# Altium project WAB_1_1_r3.PrjPcb
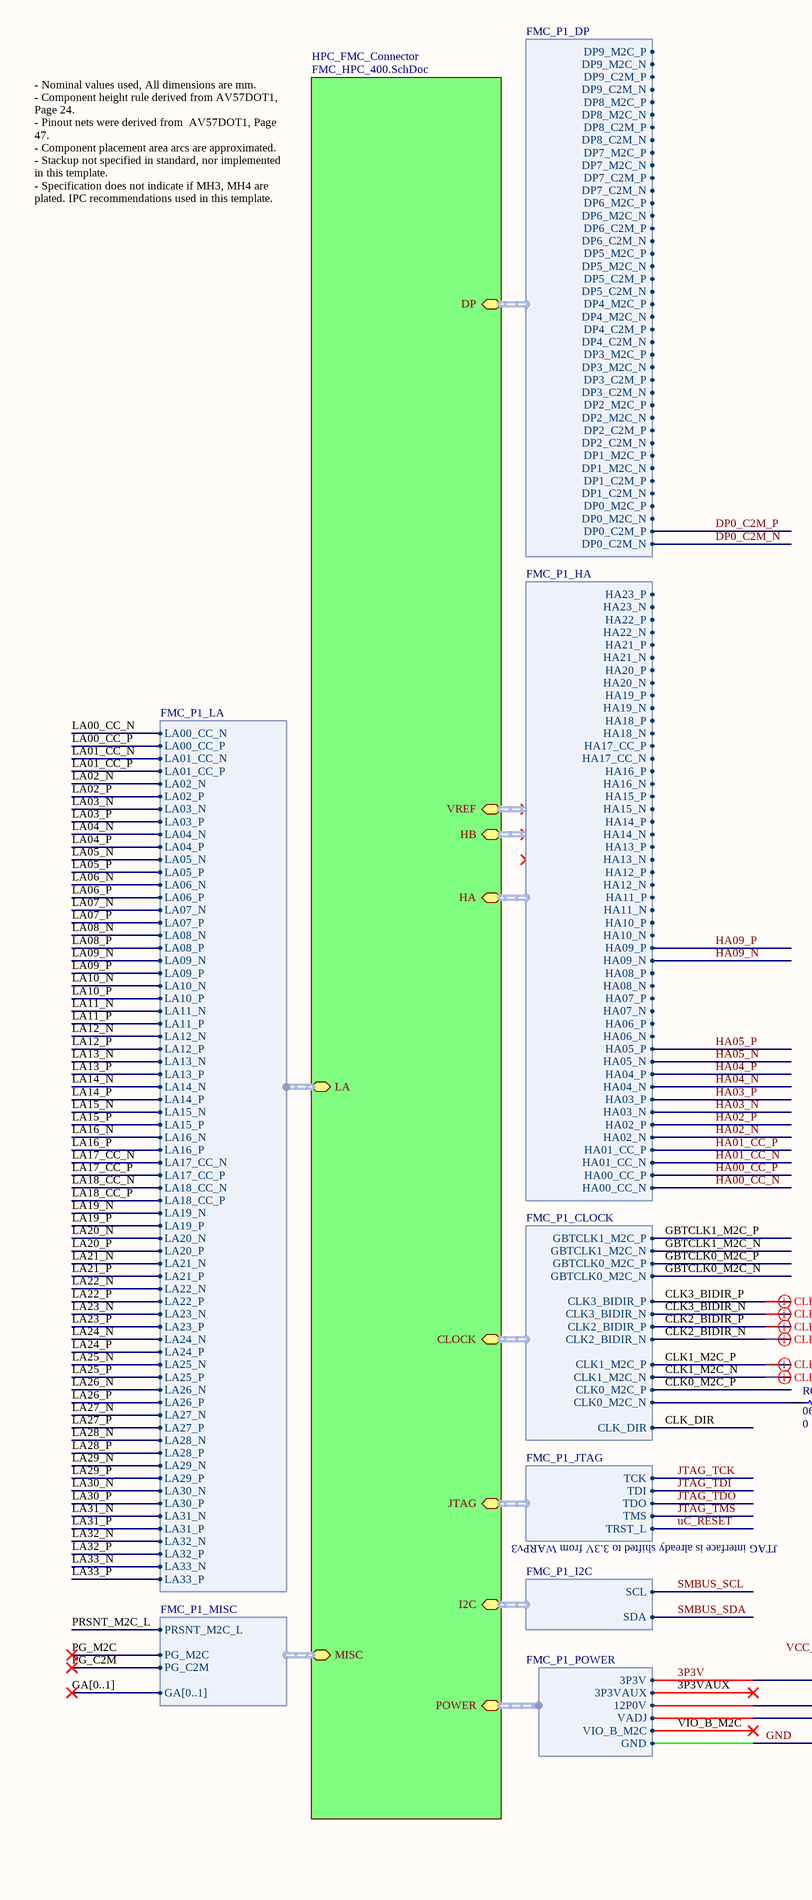
[diagram p0: WAB_1_1_top_level.SchDoc, left]
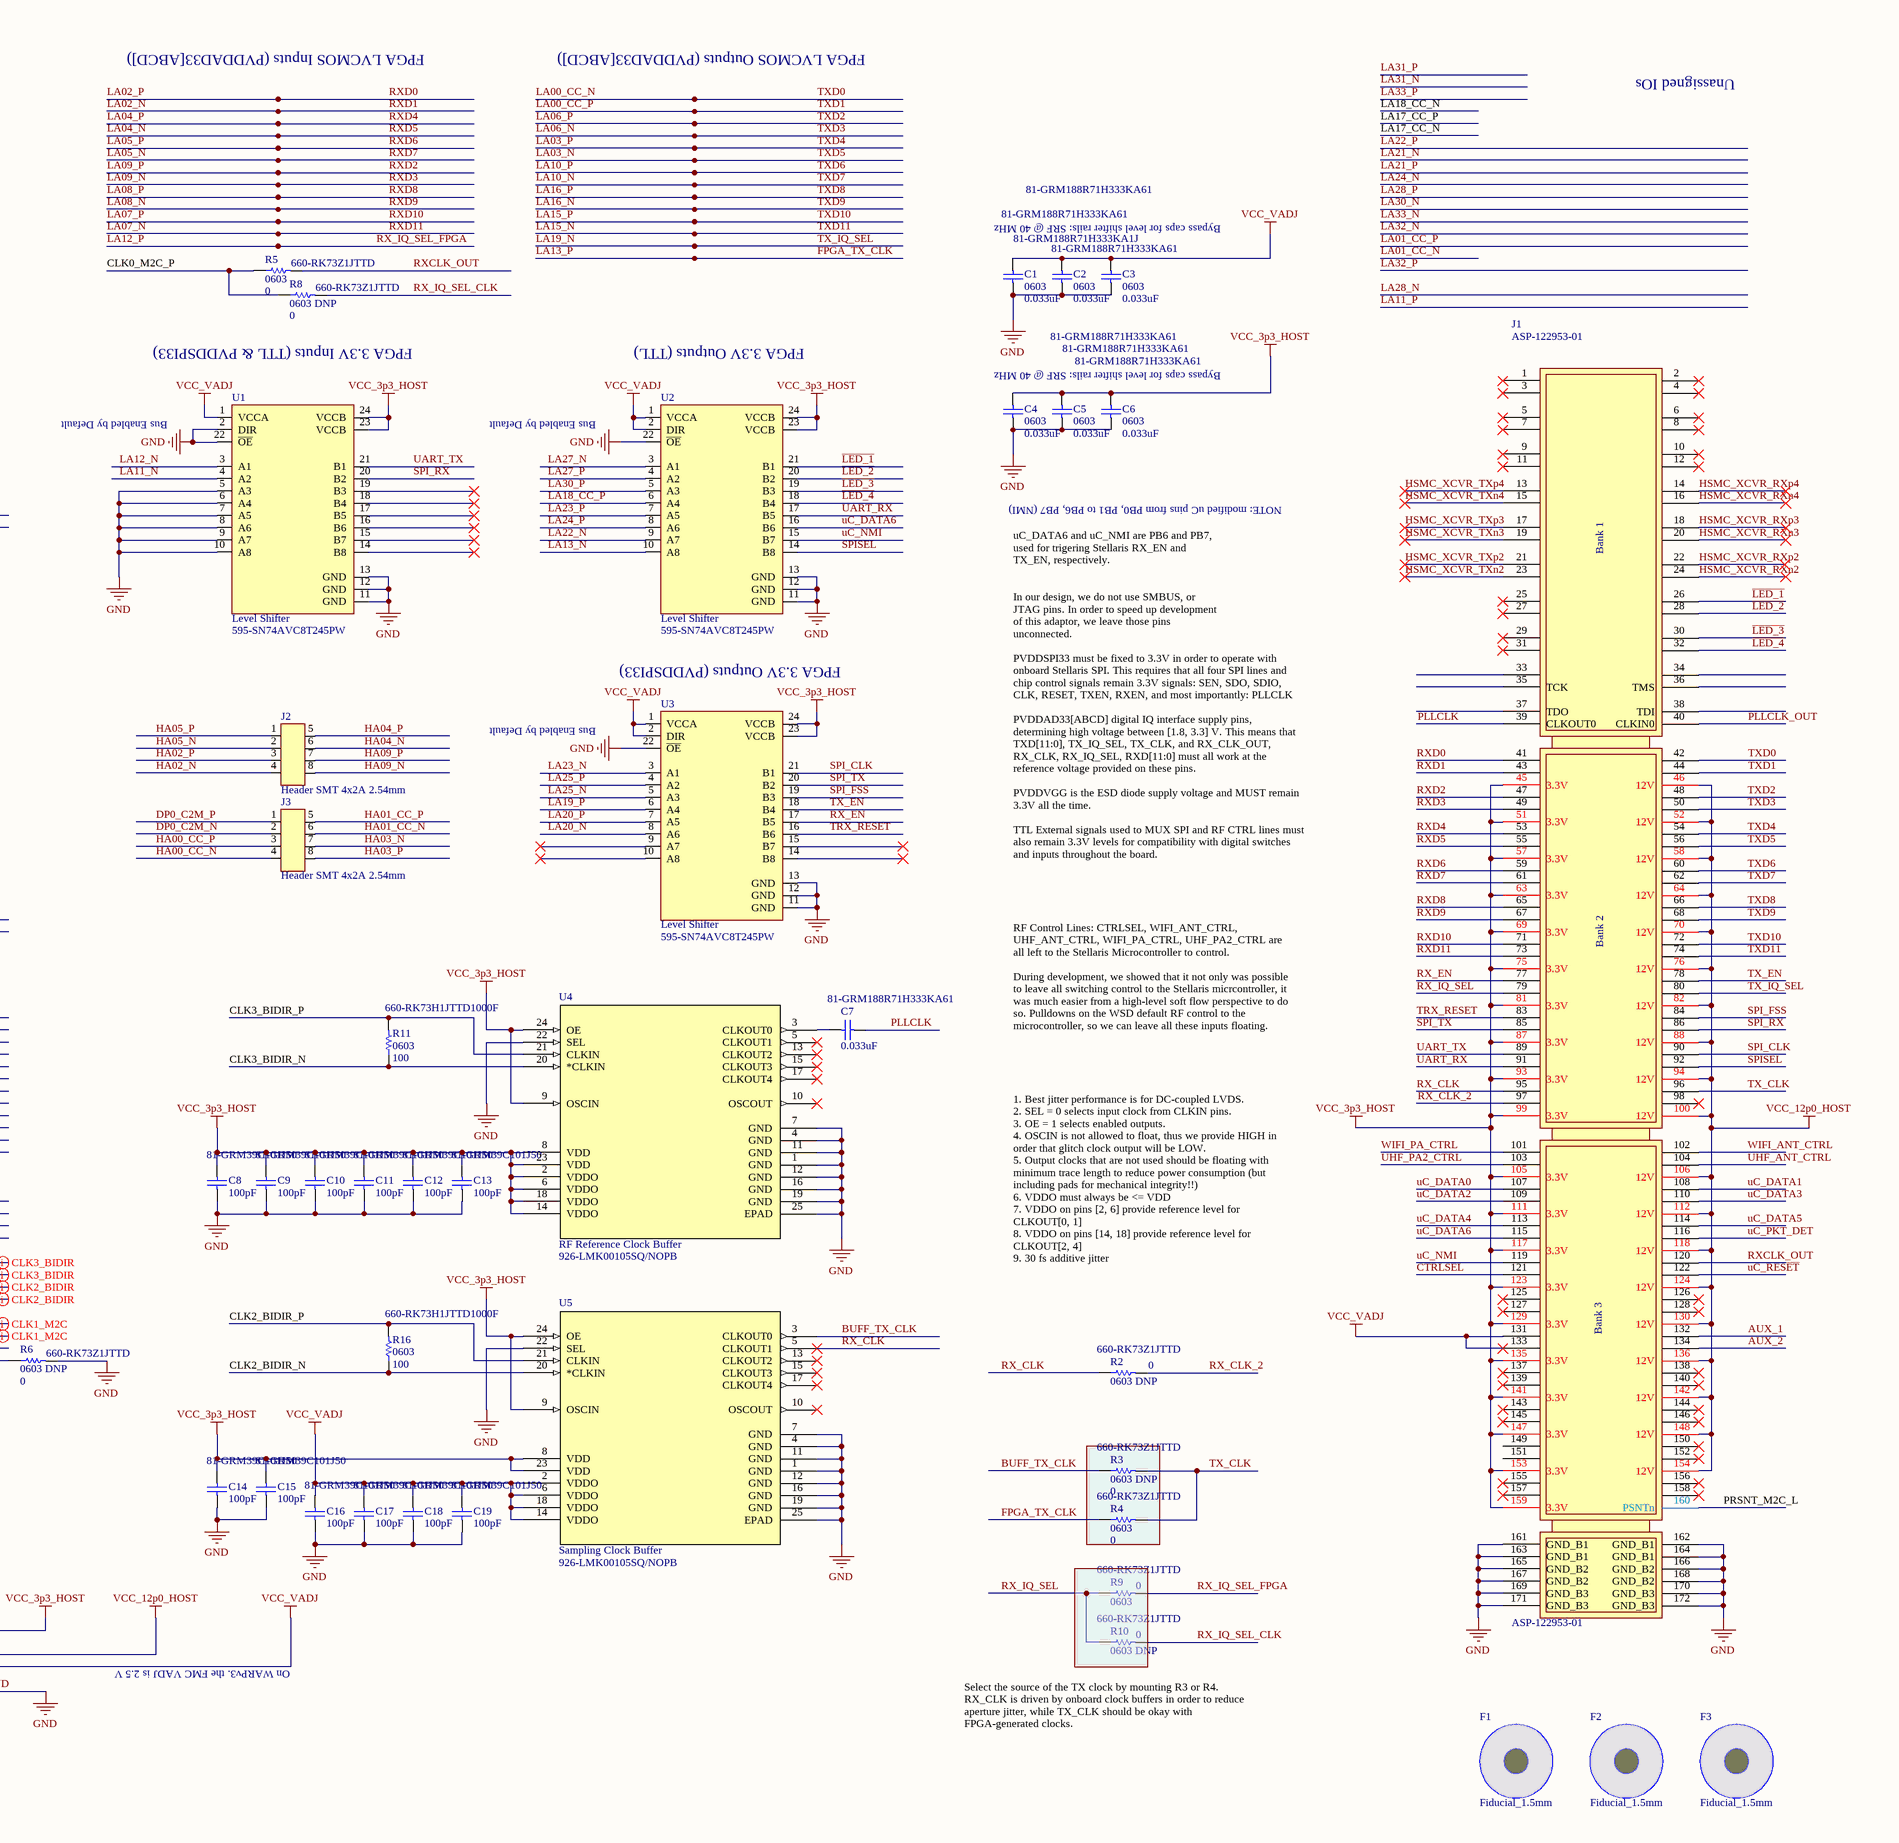
[diagram p1: WAB_1_1_top_level.SchDoc, right]
2 sheets, 41 parts. Net scope: hierarchical (ports join the sheet entries above them; power ports are global).
Board file: WAB_1_1_r3.PcbDoc
Sheets:
  WAB_1_1_top_level.SchDoc
    HPC_FMC_Connector = FMC_HPC_400.SchDoc

## Sheet WAB_1_1_top_level.SchDoc: FMC Top Sheet
size A2; DocumentNumber: 1; SheetNumber: 1; SheetTotal: 2

### Parts
C1  0603  value 0.033uF  Supplier Part Number 1: 81-GRM188R71H333KA1J  Supplier Part Number 2: 81-GRM188R71H333KA61  [0603_SMT_v3]
C2  0603  value 0.033uF  Supplier Part Number 2: 81-GRM188R71H333KA61  [0603_SMT_v3]
C3  0603  value 0.033uF  Supplier Part Number 2: 81-GRM188R71H333KA61  [0603_SMT_v3]
C4  0603  value 0.033uF  Supplier Part Number 2: 81-GRM188R71H333KA61  [0603_SMT_v3]
C5  0603  value 0.033uF  Supplier Part Number 2: 81-GRM188R71H333KA61  [0603_SMT_v3]
C6  0603  value 0.033uF  Supplier Part Number 2: 81-GRM188R71H333KA61  [0603_SMT_v3]
C7  value 0.033uF  Supplier Part Number 1: 81-GRM188R71H333KA61  [0603_SMT_v3]  (hidden comment: 0603)
C8  value 100pF  Supplier Part Number 1: 81-GRM39C101J50  [0603_SMT_v3]  (hidden comment: 0603)
C9  value 100pF  Supplier Part Number 1: 81-GRM39C101J50  [0603_SMT_v3]  (hidden comment: 0603)
C10  value 100pF  Supplier Part Number 1: 81-GRM39C101J50  [0603_SMT_v3]  (hidden comment: 0603)
C11  value 100pF  Supplier Part Number 1: 81-GRM39C101J50  [0603_SMT_v3]  (hidden comment: 0603)
C12  value 100pF  Supplier Part Number 1: 81-GRM39C101J50  [0603_SMT_v3]  (hidden comment: 0603)
C13  value 100pF  Supplier Part Number 1: 81-GRM39C101J50  [0603_SMT_v3]  (hidden comment: 0603)
C14  value 100pF  Supplier Part Number 1: 81-GRM39C101J50  [0603_SMT_v3]  (hidden comment: 0603)
C15  value 100pF  Supplier Part Number 1: 81-GRM39C101J50  [0603_SMT_v3]  (hidden comment: 0603)
C16  value 100pF  Supplier Part Number 1: 81-GRM39C101J50  [0603_SMT_v3]  (hidden comment: 0603)
C17  value 100pF  Supplier Part Number 1: 81-GRM39C101J50  [0603_SMT_v3]  (hidden comment: 0603)
C18  value 100pF  Supplier Part Number 1: 81-GRM39C101J50  [0603_SMT_v3]  (hidden comment: 0603)
C19  value 100pF  Supplier Part Number 1: 81-GRM39C101J50  [0603_SMT_v3]  (hidden comment: 0603)
F1  Fiducial_1.5mm  [1.5mm_FIDUCIAL_v4]
F2  Fiducial_1.5mm  [1.5mm_FIDUCIAL_v4]
F3  Fiducial_1.5mm  [1.5mm_FIDUCIAL_v4]
J1  ASP-122953-01  [ASP-122953-01_v2]
J2  Header SMT 4x2A 2.54mm  [2.54mm_4x2_HDR]
J3  Header SMT 4x2A 2.54mm  [2.54mm_4x2_HDR]
R2  0603 DNP  value 0  Supplier Part Number 1: 660-RK73Z1JTTD  [0603_SMT_v3]
R3  0603 DNP  value 0  Supplier Part Number 1: 660-RK73Z1JTTD  [0603_SMT_v3]
R4  0603  value 0  Supplier Part Number 1: 660-RK73Z1JTTD  [0603_SMT_v3]
R5  0603  value 0  Supplier Part Number 1: 660-RK73Z1JTTD  [0603_SMT_v3]
R6  0603 DNP  value 0  Supplier Part Number 1: 660-RK73Z1JTTD  [0603_SMT_v3]
R8  0603 DNP  value 0  Supplier Part Number 1: 660-RK73Z1JTTD  [0603_SMT_v3]
R9  0603  value 0  Supplier Part Number 1: 660-RK73Z1JTTD  [0603_SMT_v3]
R10  0603 DNP  value 0  Supplier Part Number 1: 660-RK73Z1JTTD  [0603_SMT_v3]
R11  0603  value 100  Supplier Part Number 1: 660-RK73H1JTTD1000F  [0603_SMT_v3]
R16  0603  value 100  Supplier Part Number 1: 660-RK73H1JTTD1000F  [0603_SMT_v3]
U1  Level Shifter  Supplier Part Number 1: 595-SN74AVC8T245PW  [TSSOP-24_TI]
U2  Level Shifter  Supplier Part Number 1: 595-SN74AVC8T245PW  [TSSOP-24_TI]
U3  Level Shifter  Supplier Part Number 1: 595-SN74AVC8T245PW  [TSSOP-24_TI]
U4  RF Reference Clock Buffer  Supplier Part Number 1: 926-LMK00105SQ/NOPB  [RTW24]
U5  Sampling Clock Buffer  Supplier Part Number 1: 926-LMK00105SQ/NOPB  [RTW24]

### Sub-sheets
HPC_FMC_Connector = FMC_HPC_400.SchDoc: LA (harness FMC_P1_LA), MISC (harness FMC_P1_MISC), POWER (harness FMC_P1_POWER), JTAG (harness FMC_P1_JTAG), I2C (harness FMC_P1_I2C), CLOCK (harness FMC_P1_CLOCK), VREF (harness FMC_P1_VREF), HB (harness FMC_P1_HB), DP (harness FMC_P1_DP), HA (harness FMC_P1_HA)

### Harnesses
FMC_P1_MISC: PRSNT_M2C_L, PG_M2C, PG_C2M, GA[0..1]
FMC_P1_JTAG: TCK, TDI, TDO, TMS, TRST_L
FMC_P1_I2C: SCL, SDA
FMC_P1_LA: LA05_N, LA05_P, LA06_N, LA06_P, LA09_N, LA09_P, LA10_N, LA10_P, LA13_N, LA13_P, LA14_N, LA14_P, LA23_N, LA23_P, LA26_N, LA26_P, LA27_N, LA27_P, LA02_N, LA02_P, LA03_N, LA03_P, LA04_N, LA04_P, LA07_N, LA07_P, LA08_N, LA08_P, LA11_N, LA11_P, LA12_N, LA12_P, LA15_N, LA15_P, LA16_N, LA16_P, LA19_N, LA19_P, LA20_N, LA20_P, LA21_N, LA21_P, LA22_N, LA22_P, LA24_N, LA24_P, LA25_N, LA25_P, LA28_N, LA28_P, LA29_N, LA29_P, LA30_N, LA30_P, LA31_N, LA31_P, LA32_N, LA32_P, LA33_N, LA33_P, LA00_CC_N, LA00_CC_P, LA01_CC_N, LA01_CC_P, LA17_CC_N, LA17_CC_P, LA18_CC_N, LA18_CC_P
FMC_P1_CLOCK: CLK2_BIDIR_N, CLK2_BIDIR_P, CLK3_BIDIR_N, CLK3_BIDIR_P, CLK0_M2C_N, CLK0_M2C_P, CLK1_M2C_N, CLK1_M2C_P, CLK_DIR, GBTCLK0_M2C_N, GBTCLK0_M2C_P, GBTCLK1_M2C_N, GBTCLK1_M2C_P
FMC_P1_POWER: 12P0V, 3P3V, 3P3VAUX, GND, VADJ, VIO_B_M2C
FMC_P1_HA: HA00_CC_N, HA00_CC_P, HA01_CC_N, HA01_CC_P, HA02_N, HA02_P, HA03_N, HA03_P, HA04_N, HA04_P, HA05_N, HA05_P, HA06_N, HA06_P, HA07_N, HA07_P, HA08_N, HA08_P, HA09_N, HA09_P, HA10_N, HA10_P, HA11_N, HA11_P, HA12_N, HA12_P, HA13_N, HA13_P, HA14_N, HA14_P, HA15_N, HA15_P, HA16_N, HA16_P, HA17_CC_N, HA17_CC_P, HA18_N, HA18_P, HA19_N, HA19_P, HA20_N, HA20_P, HA21_N, HA21_P, HA22_N, HA22_P, HA23_N, HA23_P
FMC_P1_DP: DP0_C2M_N, DP0_C2M_P, DP0_M2C_N, DP0_M2C_P, DP1_C2M_N, DP1_C2M_P, DP1_M2C_N, DP1_M2C_P, DP2_C2M_N, DP2_C2M_P, DP2_M2C_N, DP2_M2C_P, DP3_C2M_N, DP3_C2M_P, DP3_M2C_N, DP3_M2C_P, DP4_C2M_N, DP4_C2M_P, DP4_M2C_N, DP4_M2C_P, DP5_C2M_N, DP5_C2M_P, DP5_M2C_N, DP5_M2C_P, DP6_C2M_N, DP6_C2M_P, DP6_M2C_N, DP6_M2C_P, DP7_C2M_N, DP7_C2M_P, DP7_M2C_N, DP7_M2C_P, DP8_C2M_N, DP8_C2M_P, DP8_M2C_N, DP8_M2C_P, DP9_C2M_N, DP9_C2M_P, DP9_M2C_N, DP9_M2C_P

### Nets
3P3V: C4.2 C5.2 C6.2 C8.2 C9.2 C10.2 C11.2 C12.2 C13.2 C14.2 C15.2 J1.45(3.3V) J1.51(3.3V) J1.57(3.3V) J1.63(3.3V) J1.69(3.3V) J1.75(3.3V) J1.81(3.3V) J1.87(3.3V) J1.93(3.3V) J1.99(3.3V) J1.105(3.3V) J1.111(3.3V) J1.117(3.3V) J1.123(3.3V) J1.129(3.3V) J1.135(3.3V) J1.141(3.3V) J1.147(3.3V) J1.153(3.3V) J1.159(3.3V) U1.23(VCCB) U1.24(VCCB) U2.23(VCCB) U2.24(VCCB) U3.23(VCCB) U3.24(VCCB) U4.2(VDDO) U4.6(VDDO) U4.8(VDD) U4.9(OSCIN) U4.14(VDDO) U4.18(VDDO) U4.23(VDD) U4.24(OE) U5.8(VDD) U5.9(OSCIN) U5.23(VDD) U5.24(OE) ; sheet HPC_FMC_Connector/POWER.3P3V  [also labelled VCC_3p3_HOST]
GND: C1.1 C2.1 C3.1 C4.1 C5.1 C6.1 C8.1 C9.1 C10.1 C11.1 C12.1 C13.1 C14.1 C15.1 C16.1 C17.1 C18.1 C19.1 J1.161(GND_B1) J1.162(GND_B1) J1.163(GND_B1) J1.164(GND_B1) J1.165(GND_B2) J1.166(GND_B2) J1.167(GND_B2) J1.168(GND_B2) J1.169(GND_B3) J1.170(GND_B3) J1.171(GND_B3) J1.172(GND_B3) R6.2 U1.2(DIR) U1.5(A3) U1.6(A4) U1.7(A5) U1.8(A6) U1.9(A7) U1.10(A8) U1.11(GND) U1.12(GND) U1.13(GND) U1.22(~{OE}) U2.11(GND) U2.12(GND) U2.13(GND) U2.22(~{OE}) U3.11(GND) U3.12(GND) U3.13(GND) U3.22(~{OE}) U4.1(GND) U4.4(GND) U4.7(GND) U4.11(GND) U4.12(GND) U4.16(GND) U4.19(GND) U4.22(SEL) U4.25(EPAD) U5.1(GND) U5.4(GND) U5.7(GND) U5.11(GND) U5.12(GND) U5.16(GND) U5.19(GND) U5.22(SEL) U5.25(EPAD) ; sheet HPC_FMC_Connector/POWER.GND
VCC_12p0_HOST: J1.46(12V) J1.52(12V) J1.58(12V) J1.64(12V) J1.70(12V) J1.76(12V) J1.82(12V) J1.88(12V) J1.94(12V) J1.100(12V) J1.106(12V) J1.112(12V) J1.118(12V) J1.124(12V) J1.130(12V) J1.136(12V) J1.142(12V) J1.148(12V) J1.154(12V) ; sheet HPC_FMC_Connector/POWER.12P0V  [project net 12P0V]
VCC_VADJ: C1.2 C2.2 C3.2 C16.2 C17.2 C18.2 C19.2 J1.131 J1.133 U1.1(VCCA) U2.1(VCCA) U2.2(DIR) U3.1(VCCA) U3.2(DIR) U5.2(VDDO) U5.6(VDDO) U5.14(VDDO) U5.18(VDDO) ; sheet HPC_FMC_Connector/POWER.VADJ  [project net VADJ]
~{LED_1}: J1.26 U2.21(B1)
~{LED_2}: J1.28 U2.20(B2)
~{LED_3}: J1.30 U2.19(B3)
~{LED_4}: J1.32 U2.18(B4)
~{uC_RESET}: J1.122 ; sheet HPC_FMC_Connector/JTAG.TRST_L
AUX_1: J1.132
AUX_2: J1.134
BUFF_TX_CLK: R3.1 U5.3(CLKOUT0)
CLK0_M2C_N: R6.1 ; sheet HPC_FMC_Connector/CLOCK.CLK0_M2C_N
CLK0_M2C_P: R5.1 R8.1 ; sheet HPC_FMC_Connector/CLOCK.CLK0_M2C_P
CLK2_BIDIR_N: R16.1 U5.20(*CLKIN) ; sheet HPC_FMC_Connector/CLOCK.CLK2_BIDIR_N
CLK2_BIDIR_P: R16.2 U5.21(CLKIN) ; sheet HPC_FMC_Connector/CLOCK.CLK2_BIDIR_P
CLK3_BIDIR_N: R11.1 U4.20(*CLKIN) ; sheet HPC_FMC_Connector/CLOCK.CLK3_BIDIR_N
CLK3_BIDIR_P: R11.2 U4.21(CLKIN) ; sheet HPC_FMC_Connector/CLOCK.CLK3_BIDIR_P
CTRLSEL: J1.121
DP0_C2M_N: J3.2 ; sheet HPC_FMC_Connector/DP.DP0_C2M_N
DP0_C2M_P: J3.1 ; sheet HPC_FMC_Connector/DP.DP0_C2M_P
FPGA_TX_CLK: R4.1 ; sheet HPC_FMC_Connector/LA.LA13_P  [also labelled LA13_P]
GBTCLK1_M2C_N: sheet HPC_FMC_Connector/CLOCK.GBTCLK1_M2C_N
GBTCLK1_M2C_P: sheet HPC_FMC_Connector/CLOCK.GBTCLK1_M2C_P
HA00_CC_N: J3.4 ; sheet HPC_FMC_Connector/HA.HA00_CC_N
HA00_CC_P: J3.3 ; sheet HPC_FMC_Connector/HA.HA00_CC_P
HA01_CC_N: J3.6 ; sheet HPC_FMC_Connector/HA.HA01_CC_N
HA01_CC_P: J3.5 ; sheet HPC_FMC_Connector/HA.HA01_CC_P
HA02_N: J2.4 ; sheet HPC_FMC_Connector/HA.HA02_N
HA02_P: J2.3 ; sheet HPC_FMC_Connector/HA.HA02_P
HA03_N: J3.7 ; sheet HPC_FMC_Connector/HA.HA03_N
HA03_P: J3.8 ; sheet HPC_FMC_Connector/HA.HA03_P
HA04_N: J2.6 ; sheet HPC_FMC_Connector/HA.HA04_N
HA04_P: J2.5 ; sheet HPC_FMC_Connector/HA.HA04_P
HA05_N: J2.2 ; sheet HPC_FMC_Connector/HA.HA05_N
HA05_P: J2.1 ; sheet HPC_FMC_Connector/HA.HA05_P
HA09_N: J2.8 ; sheet HPC_FMC_Connector/HA.HA09_N
HA09_P: J2.7 ; sheet HPC_FMC_Connector/HA.HA09_P
HSMC_XCVR_RXn2: J1.24
HSMC_XCVR_RXn3: J1.20
HSMC_XCVR_RXn4: J1.16
HSMC_XCVR_RXp2: J1.22
HSMC_XCVR_RXp3: J1.18
HSMC_XCVR_RXp4: J1.14
HSMC_XCVR_TXn2: J1.23
HSMC_XCVR_TXn3: J1.19
HSMC_XCVR_TXn4: J1.15
HSMC_XCVR_TXp2: J1.21
HSMC_XCVR_TXp3: J1.17
HSMC_XCVR_TXp4: J1.13
LA00_CC_N: J1.42 ; sheet HPC_FMC_Connector/LA.LA00_CC_N  [also labelled TXD0]
LA00_CC_P: J1.44 ; sheet HPC_FMC_Connector/LA.LA00_CC_P  [also labelled TXD1]
LA02_N: J1.43 ; sheet HPC_FMC_Connector/LA.LA02_N  [also labelled RXD1]
LA02_P: J1.41 ; sheet HPC_FMC_Connector/LA.LA02_P  [also labelled RXD0]
LA03_N: J1.56 ; sheet HPC_FMC_Connector/LA.LA03_N  [also labelled TXD5]
LA03_P: J1.54 ; sheet HPC_FMC_Connector/LA.LA03_P  [also labelled TXD4]
LA04_N: J1.55 ; sheet HPC_FMC_Connector/LA.LA04_N  [also labelled RXD5]
LA04_P: J1.53 ; sheet HPC_FMC_Connector/LA.LA04_P  [also labelled RXD4]
LA05_N: J1.61 ; sheet HPC_FMC_Connector/LA.LA05_N  [also labelled RXD7]
LA05_P: J1.59 ; sheet HPC_FMC_Connector/LA.LA05_P  [also labelled RXD6]
LA06_N: J1.50 ; sheet HPC_FMC_Connector/LA.LA06_N  [also labelled TXD3]
LA06_P: J1.48 ; sheet HPC_FMC_Connector/LA.LA06_P  [also labelled TXD2]
LA07_N: J1.73 ; sheet HPC_FMC_Connector/LA.LA07_N  [also labelled RXD11]
LA07_P: J1.71 ; sheet HPC_FMC_Connector/LA.LA07_P  [also labelled RXD10]
LA08_N: J1.67 ; sheet HPC_FMC_Connector/LA.LA08_N  [also labelled RXD9]
LA08_P: J1.65 ; sheet HPC_FMC_Connector/LA.LA08_P  [also labelled RXD8]
LA09_N: J1.49 ; sheet HPC_FMC_Connector/LA.LA09_N  [also labelled RXD3]
LA09_P: J1.47 ; sheet HPC_FMC_Connector/LA.LA09_P  [also labelled RXD2]
LA10_N: J1.62 ; sheet HPC_FMC_Connector/LA.LA10_N  [also labelled TXD7]
LA10_P: J1.60 ; sheet HPC_FMC_Connector/LA.LA10_P  [also labelled TXD6]
LA11_N: U1.4(A2) ; sheet HPC_FMC_Connector/LA.LA11_N
LA12_N: U1.3(A1) ; sheet HPC_FMC_Connector/LA.LA12_N
LA12_P: R9.2 ; sheet HPC_FMC_Connector/LA.LA12_P  [also labelled RX_IQ_SEL_FPGA]
LA13_N: U2.10(A8) ; sheet HPC_FMC_Connector/LA.LA13_N
LA15_N: J1.74 ; sheet HPC_FMC_Connector/LA.LA15_N  [also labelled TXD11]
LA15_P: J1.72 ; sheet HPC_FMC_Connector/LA.LA15_P  [also labelled TXD10]
LA16_N: J1.68 ; sheet HPC_FMC_Connector/LA.LA16_N  [also labelled TXD9]
LA16_P: J1.66 ; sheet HPC_FMC_Connector/LA.LA16_P  [also labelled TXD8]
LA18_CC_P: U2.6(A4) ; sheet HPC_FMC_Connector/LA.LA18_CC_P
LA19_N: J1.80 ; sheet HPC_FMC_Connector/LA.LA19_N  [also labelled TX_IQ_SEL]
LA19_P: U3.6(A4) ; sheet HPC_FMC_Connector/LA.LA19_P
LA20_N: U3.8(A6) ; sheet HPC_FMC_Connector/LA.LA20_N
LA20_P: U3.7(A5) ; sheet HPC_FMC_Connector/LA.LA20_P
LA22_N: U2.9(A7) ; sheet HPC_FMC_Connector/LA.LA22_N
LA23_N: U3.3(A1) ; sheet HPC_FMC_Connector/LA.LA23_N
LA23_P: U2.7(A5) ; sheet HPC_FMC_Connector/LA.LA23_P
LA24_P: U2.8(A6) ; sheet HPC_FMC_Connector/LA.LA24_P
LA25_N: U3.5(A3) ; sheet HPC_FMC_Connector/LA.LA25_N
LA25_P: U3.4(A2) ; sheet HPC_FMC_Connector/LA.LA25_P
LA27_N: U2.3(A1) ; sheet HPC_FMC_Connector/LA.LA27_N
LA27_P: U2.4(A2) ; sheet HPC_FMC_Connector/LA.LA27_P
LA30_P: U2.5(A3) ; sheet HPC_FMC_Connector/LA.LA30_P
PLLCLK: C7.1 J1.39(CLKOUT0)
PLLCLK_OUT: J1.40(CLKIN0)
PRSNT_M2C_L: J1.160(PSNTn) ; sheet HPC_FMC_Connector/MISC.PRSNT_M2C_L
RX_CLK: J1.95 R2.1 U5.5(CLKOUT1)
RX_CLK_2: J1.97 R2.2
RX_EN: J1.77 U3.17(B5)
RX_IQ_SEL: J1.79 R9.1 R10.1
RX_IQ_SEL_CLK: R8.2 R10.2
RXCLK_OUT: J1.120 R5.2
SPI_CLK: J1.90 U3.21(B1)
SPI_FSS: J1.84 U3.19(B3)
SPI_RX: J1.86 U1.20(B2)
SPI_TX: J1.85 U3.20(B2)
SPISEL: J1.92 U2.14(B8)
TRX_RESET: J1.83 U3.16(B6)
TX_CLK: J1.96 R3.2 R4.2
TX_EN: J1.78 U3.18(B4)
UART_RX: J1.91 U2.17(B5)
UART_TX: J1.89 U1.21(B1)
uC_DATA0: J1.107
uC_DATA1: J1.108
uC_DATA2: J1.109
uC_DATA3: J1.110
uC_DATA4: J1.113
uC_DATA5: J1.114
uC_DATA6: J1.115 U2.16(B6)
uC_NMI: J1.119 U2.15(B7)
uC_PKT_DET: J1.116
UHF_ANT_CTRL: J1.104
UHF_PA2_CTRL: J1.103
WIFI_ANT_CTRL: J1.102
WIFI_PA_CTRL: J1.101
NetC7_2: C7.2 U4.3(CLKOUT0)

Not connected (* = marked no-connect by the designer): J1 1* 2* 3* 4* 5* 6* 7* 8* 9* 10* 11* 12* 25* 27* 29* 31* 33(SDA) 34(SCL) 35(TCK) 36(TMS) 37(TDO) 38(TDI) 98* 125* 126* 127* 128* 137* 138* 139* 140* 143* 144* 145* 146* 149 150* 151 152* 155* 156* 157* 158*; U1 14(B8)* 15(B7)* 16(B6)* 17(B5)* 18(B4)* 19(B3)*; U3 9(A7)* 10(A8)* 14(B8)* 15(B7)*; U4 5(CLKOUT1)* 10(OSCOUT)* 13(CLKOUT2)* 15(CLKOUT3)* 17(CLKOUT4)*; U5 10(OSCOUT)* 13(CLKOUT2)* 15(CLKOUT3)* 17(CLKOUT4)*

### Buses and harness runs
bus GA[0..1]

### Layout directives
differential pair: CLK1_M2C_N, CLK1_M2C_P, CLK2_BIDIR_N, CLK2_BIDIR_P, CLK3_BIDIR_N, CLK3_BIDIR_P

### Notes on the sheet
- FPGA LVCMOS Inputs (PVDDAD33[ABCD])
- FPGA LVCMOS Outputs (PVDDAD33[ABCD])
- Unassigned IOs
- Bypass caps for level shifter rails: SRF @ 40 MHz
- - Nominal values used, All dimensions are mm.
  - Component height rule derived from AV57DOT1, Page 24.
  - Pinout nets were derived from  AV57DOT1, Page 47.
  - Component placement area arcs are approximated.
  - Stackup not specified in standard, nor implemented in this template.
  - Specification does not indicate if MH3, MH4 are plated. IPC recommendations used in this template.
- FPGA 3.3V Inputs (TTL & PVDDSPI33)
- FPGA 3.3V Outputs (TTL)
- Bus Enabled by Default
- NOTE: modified uC pins from PB0, PB1 to PB6, PB7 (NMI)
- uC_DATA6 and uC_NMI are PB6 and PB7, used for trigering Stellaris RX_EN and TX_EN, respectively.
- FPGA 3.3V Outputs (PVDDSPI33)
- In our design, we do not use SMBUS, or JTAG pins. In order to speed up development of this adaptor, we leave those pins unconnected.
- PVDDSPI33 must be fixed to 3.3V in order to operate with onboard Stellaris SPI. This requires that all four SPI lines and chip control signals remain 3.3V signals: SEN, SDO, SDIO, CLK, RESET, TXEN, RXEN, and most importantly: PLLCLK
  PVDDAD33[ABCD] digital IQ interface supply pins, determining high voltage between [1.8, 3.3] V. This means that TXD[11:0], TX_IQ_SEL, TX_CLK, and RX_CLK_OUT, RX_CLK, RX_IQ_SEL, RXD[11:0] must all work at the reference voltage provided on these pins.
  PVDDVGG is the ESD diode supply voltage and MUST remain 3.3V all the time.
  TTL External signals used to MUX SPI and RF CTRL lines must also remain 3.3V levels for compatibility with digital switches and inputs throughout the board.
- RF Control Lines: CTRLSEL, WIFI_ANT_CTRL, UHF_ANT_CTRL, WIFI_PA_CTRL, UHF_PA2_CTRL are all left to the Stellaris Microcontroller to control.
  During development, we showed that it not only was possible to leave all switching control to the Stellaris micrcontroller, it was much easier from a high-level soft flow perspective to do so. Pulldowns on the WSD default RF control to the microcontroller, so we can leave all these inputs floating.
- 1. Best jitter performance is for DC-coupled LVDS.
  2. SEL = 0 selects input clock from CLKIN pins.
  3. OE = 1 selects enabled outputs.
  4. OSCIN is not allowed to float, thus we provide HIGH in order that glitch clock output will be LOW.
  5. Output clocks that are not used should be floating with minimum trace length to reduce power consumption (but including pads for mechanical integrity!!)
  6. VDDO must always be <= VDD
  7. VDDO on pins [2, 6] provide reference level for
  CLKOUT[0, 1]
  8. VDDO on pins [14, 18] provide reference level for
  CLKOUT[2, 4]
  9. 30 fs additive jitter
- JTAG interface is already shifted to 3.3V from WARPv3
- On WARPv3. the FMC VADJ is 2.5 V
- (near R10) Select the source of the TX clock by mounting R3 or R4. RX_CLK is driven by onboard clock buffers in order to reduce aperture jitter, while TX_CLK should be okay with FPGA-generated clocks.
- Sheet Title
- Project Title
- Size:
- Date:
- A3
- Item:
- Time:
- Revision:
- Sheet
- of
- File:
- (in symbol ASP-122953-01) Bank 1; Bank 2; Bank 3

### Library data of the parts
C1-C6 = Cap Semi: Capacitor (Semiconductor SIM Model); Published: 8-Jun-2000; LatestRevisionDate: 29-May-2009; LatestRevisionNote: IPC-7351 Footprint Added.; PackageReference: C1206; Publisher: Altium Limited; PackageDescription: Chip Capacitor; Supplier 1: Mouser; Supplier 2: Mouser
  C2-C6: Supplier Part Number 1: 81-GRM188R71H333KA1J
C7-C19 = Cap_0603: Supplier 1: Mouser
J1 = ASP-122953-01: Samtec HSMC Host Connector (Female)
R2-R6 R8-R11 R16 = Res_0603: 0603 SMT Resistor; Supplier 1: Mouser
U1-U3 = SN74AVC8T245PW: 8-bit Dual Supply Bus Transceiver; Supplier 1: Mouser
U4 U5 = LMK00105_RTW_24: TI Universal-to-CMOS 5-Output Clock Buffer; Vendor: TEXAS INSTRUMENTS; Manufacturer_Part_Number: lmk00105_rtw_24; RefDes: RefDes; Type: DEV; Value: Value; Supplier 1: Mouser

## Sheet FMC_HPC_400.SchDoc: FMC P1 400 Pin
size A3
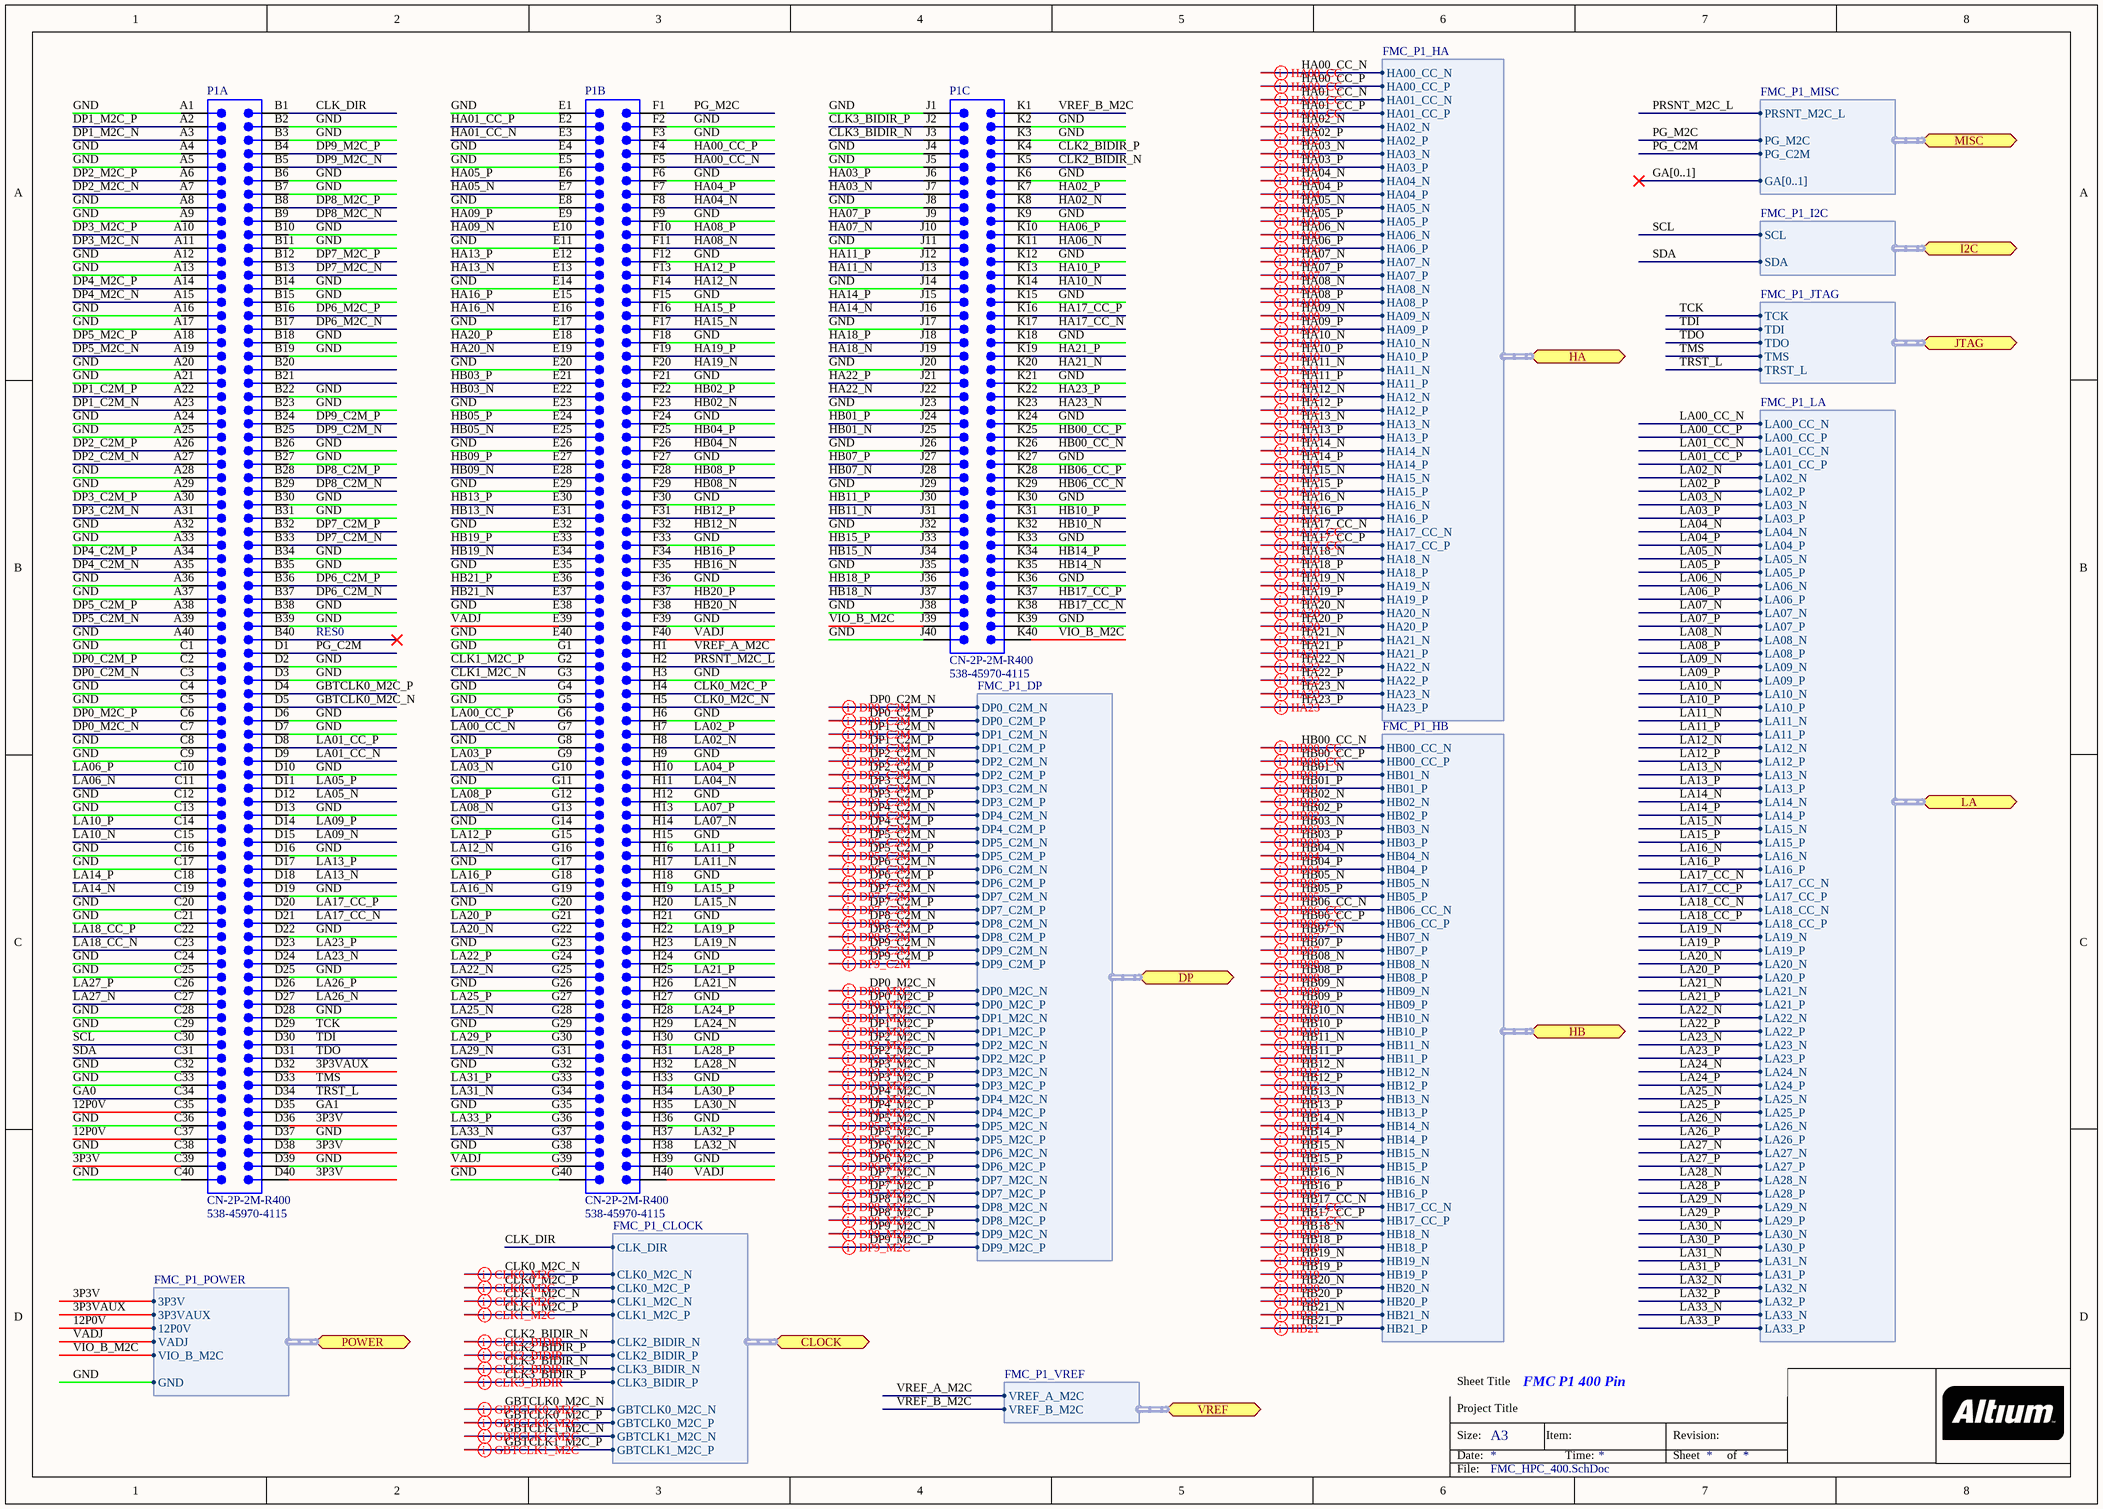
[diagram p2: FMC_HPC_400.SchDoc]

### Parts
P1  CN-2P-2M-R400  Supplier Part Number 1: 538-45970-4115  [BTB-SM1-27-2V400M]  (parts A,B,C of 3)

### Ports
CLOCK (harness FMC_P1_CLOCK), DP (harness FMC_P1_DP), HA (harness FMC_P1_HA), HB (harness FMC_P1_HB), I2C (harness FMC_P1_I2C), JTAG (harness FMC_P1_JTAG), LA (harness FMC_P1_LA), MISC (harness FMC_P1_MISC), POWER (harness FMC_P1_POWER), VREF (harness FMC_P1_VREF)

### Harnesses
FMC_P1_LA: LA05_N, LA05_P, LA06_N, LA06_P, LA09_N, LA09_P, LA10_N, LA10_P, LA13_N, LA13_P, LA14_N, LA14_P, LA23_N, LA23_P, LA26_N, LA26_P, LA27_N, LA27_P, LA02_N, LA02_P, LA03_N, LA03_P, LA04_N, LA04_P, LA07_N, LA07_P, LA08_N, LA08_P, LA11_N, LA11_P, LA12_N, LA12_P, LA15_N, LA15_P, LA16_N, LA16_P, LA19_N, LA19_P, LA20_N, LA20_P, LA21_N, LA21_P, LA22_N, LA22_P, LA24_N, LA24_P, LA25_N, LA25_P, LA28_N, LA28_P, LA29_N, LA29_P, LA30_N, LA30_P, LA31_N, LA31_P, LA32_N, LA32_P, LA33_N, LA33_P, LA00_CC_N, LA00_CC_P, LA01_CC_N, LA01_CC_P, LA17_CC_N, LA17_CC_P, LA18_CC_N, LA18_CC_P
FMC_P1_MISC: PRSNT_M2C_L, PG_M2C, PG_C2M, GA[0..1]
FMC_P1_POWER: 3P3V, 3P3VAUX, 12P0V, VADJ, VIO_B_M2C, GND
FMC_P1_JTAG: TCK, TDI, TDO, TMS, TRST_L
FMC_P1_I2C: SCL, SDA
FMC_P1_CLOCK: CLK2_BIDIR_N, CLK2_BIDIR_P, CLK3_BIDIR_N, CLK3_BIDIR_P, CLK0_M2C_N, CLK0_M2C_P, CLK1_M2C_N, CLK1_M2C_P, CLK_DIR, GBTCLK0_M2C_N, GBTCLK0_M2C_P, GBTCLK1_M2C_N, GBTCLK1_M2C_P
FMC_P1_VREF: VREF_A_M2C, VREF_B_M2C
FMC_P1_HB: HB02_N, HB02_P, HB03_N, HB03_P, HB04_N, HB04_P, HB05_N, HB05_P, HB08_N, HB08_P, HB09_N, HB09_P, HB12_N, HB12_P, HB13_N, HB13_P, HB16_N, HB16_P, HB19_N, HB19_P, HB20_N, HB20_P, HB21_N, HB21_P, HB01_N, HB01_P, HB07_N, HB07_P, HB10_N, HB10_P, HB11_N, HB11_P, HB14_N, HB14_P, HB15_N, HB15_P, HB18_N, HB18_P, HB17_CC_N, HB17_CC_P, HB06_CC_N, HB06_CC_P, HB00_CC_N, HB00_CC_P
FMC_P1_DP: DP1_C2M_N, DP1_C2M_P, DP1_M2C_N, DP1_M2C_P, DP2_C2M_N, DP2_C2M_P, DP2_M2C_N, DP2_M2C_P, DP3_C2M_N, DP3_C2M_P, DP3_M2C_N, DP3_M2C_P, DP4_C2M_N, DP4_C2M_P, DP4_M2C_N, DP4_M2C_P, DP5_C2M_N, DP5_C2M_P, DP5_M2C_N, DP5_M2C_P, DP6_C2M_N, DP6_C2M_P, DP6_M2C_N, DP6_M2C_P, DP7_C2M_N, DP7_C2M_P, DP7_M2C_N, DP7_M2C_P, DP8_C2M_N, DP8_C2M_P, DP8_M2C_N, DP8_M2C_P, DP9_C2M_N, DP9_C2M_P, DP9_M2C_N, DP9_M2C_P, DP0_C2M_N, DP0_C2M_P, DP0_M2C_N, DP0_M2C_P
FMC_P1_HA: HA04_N, HA04_P, HA05_N, HA05_P, HA08_N, HA08_P, HA09_N, HA09_P, HA12_N, HA12_P, HA13_N, HA13_P, HA15_N, HA15_P, HA16_N, HA16_P, HA19_N, HA19_P, HA20_N, HA20_P, HA02_N, HA02_P, HA03_N, HA03_P, HA06_N, HA06_P, HA07_N, HA07_P, HA10_N, HA10_P, HA11_N, HA11_P, HA14_N, HA14_P, HA18_N, HA18_P, HA21_N, HA21_P, HA22_N, HA22_P, HA23_N, HA23_P, HA17_CC_N, HA17_CC_P, HA00_CC_N, HA00_CC_P, HA01_CC_N, HA01_CC_P

### Nets
3P3V: P1.C39 P1.D36 P1.D38 P1.D40 ; port POWER.3P3V
12P0V: P1.C35 P1.C37 ; port POWER.12P0V
GND: P1.A1 P1.A4 P1.A5 P1.A8 P1.A9 P1.A12 P1.A13 P1.A16 P1.A17 P1.A20 P1.A21 P1.A24 P1.A25 P1.A28 P1.A29 P1.A32 P1.A33 P1.A36 P1.A37 P1.A40 P1.B2 P1.B3 P1.B6 P1.B7 P1.B10 P1.B11 P1.B14 P1.B15 P1.B18 P1.B19 P1.B22 P1.B23 P1.B26 P1.B27 P1.B30 P1.B31 P1.B34 P1.B35 P1.B38 P1.B39 P1.C1 P1.C4 P1.C5 P1.C8 P1.C9 P1.C12 P1.C13 P1.C16 P1.C17 P1.C20 P1.C21 P1.C24 P1.C25 P1.C28 P1.C29 P1.C32 P1.C33 P1.C36 P1.C38 P1.C40 P1.D2 P1.D3 P1.D6 P1.D7 P1.D10 P1.D13 P1.D16 P1.D19 P1.D22 P1.D25 P1.D28 P1.D37 P1.D39 P1.E1 P1.E4 P1.E5 P1.E8 P1.E11 P1.E14 P1.E17 P1.E20 P1.E23 P1.E26 P1.E29 P1.E32 P1.E35 P1.E38 P1.E40 P1.F2 P1.F3 P1.F6 P1.F9 P1.F12 P1.F15 P1.F18 P1.F21 P1.F24 P1.F27 P1.F30 P1.F33 P1.F36 P1.F39 P1.G1 P1.G4 P1.G5 P1.G8 P1.G11 P1.G14 P1.G17 P1.G20 P1.G23 P1.G26 P1.G29 P1.G32 P1.G35 P1.G38 P1.G40 P1.H3 P1.H6 P1.H9 P1.H12 P1.H15 P1.H18 P1.H21 P1.H24 P1.H27 P1.H30 P1.H33 P1.H36 P1.H39 P1.J1 P1.J4 P1.J5 P1.J8 P1.J11 P1.J14 P1.J17 P1.J20 P1.J23 P1.J26 P1.J29 P1.J32 P1.J35 P1.J38 P1.J40 P1.K2 P1.K3 P1.K6 P1.K9 P1.K12 P1.K15 P1.K18 P1.K21 P1.K24 P1.K27 P1.K30 P1.K33 P1.K36 P1.K39 ; port POWER.GND
VADJ: P1.E39 P1.F40 P1.G39 P1.H40 ; port POWER.VADJ
3P3VAUX: P1.D32 ; port POWER.3P3VAUX
CLK0_M2C_N: P1.H5 ; port CLOCK.CLK0_M2C_N
CLK0_M2C_P: P1.H4 ; port CLOCK.CLK0_M2C_P
CLK1_M2C_N: P1.G3 ; port CLOCK.CLK1_M2C_N
CLK1_M2C_P: P1.G2 ; port CLOCK.CLK1_M2C_P
CLK2_BIDIR_N: P1.K5 ; port CLOCK.CLK2_BIDIR_N
CLK2_BIDIR_P: P1.K4 ; port CLOCK.CLK2_BIDIR_P
CLK3_BIDIR_N: P1.J3 ; port CLOCK.CLK3_BIDIR_N
CLK3_BIDIR_P: P1.J2 ; port CLOCK.CLK3_BIDIR_P
CLK_DIR: P1.B1 ; port CLOCK.CLK_DIR
DP0_C2M_N: P1.C3 ; port DP.DP0_C2M_N
DP0_C2M_P: P1.C2 ; port DP.DP0_C2M_P
DP0_M2C_N: P1.C7 ; port DP.DP0_M2C_N
DP0_M2C_P: P1.C6 ; port DP.DP0_M2C_P
DP1_C2M_N: P1.A23 ; port DP.DP1_C2M_N
DP1_C2M_P: P1.A22 ; port DP.DP1_C2M_P
DP1_M2C_N: P1.A3 ; port DP.DP1_M2C_N
DP1_M2C_P: P1.A2 ; port DP.DP1_M2C_P
DP2_C2M_N: P1.A27 ; port DP.DP2_C2M_N
DP2_C2M_P: P1.A26 ; port DP.DP2_C2M_P
DP2_M2C_N: P1.A7 ; port DP.DP2_M2C_N
DP2_M2C_P: P1.A6 ; port DP.DP2_M2C_P
DP3_C2M_N: P1.A31 ; port DP.DP3_C2M_N
DP3_C2M_P: P1.A30 ; port DP.DP3_C2M_P
DP3_M2C_N: P1.A11 ; port DP.DP3_M2C_N
DP3_M2C_P: P1.A10 ; port DP.DP3_M2C_P
DP4_C2M_N: P1.A35 ; port DP.DP4_C2M_N
DP4_C2M_P: P1.A34 ; port DP.DP4_C2M_P
DP4_M2C_N: P1.A15 ; port DP.DP4_M2C_N
DP4_M2C_P: P1.A14 ; port DP.DP4_M2C_P
DP5_C2M_N: P1.A39 ; port DP.DP5_C2M_N
DP5_C2M_P: P1.A38 ; port DP.DP5_C2M_P
DP5_M2C_N: P1.A19 ; port DP.DP5_M2C_N
DP5_M2C_P: P1.A18 ; port DP.DP5_M2C_P
DP6_C2M_N: P1.B37 ; port DP.DP6_C2M_N
DP6_C2M_P: P1.B36 ; port DP.DP6_C2M_P
DP6_M2C_N: P1.B17 ; port DP.DP6_M2C_N
DP6_M2C_P: P1.B16 ; port DP.DP6_M2C_P
DP7_C2M_N: P1.B33 ; port DP.DP7_C2M_N
DP7_C2M_P: P1.B32 ; port DP.DP7_C2M_P
DP7_M2C_N: P1.B13 ; port DP.DP7_M2C_N
DP7_M2C_P: P1.B12 ; port DP.DP7_M2C_P
DP8_C2M_N: P1.B29 ; port DP.DP8_C2M_N
DP8_C2M_P: P1.B28 ; port DP.DP8_C2M_P
DP8_M2C_N: P1.B9 ; port DP.DP8_M2C_N
DP8_M2C_P: P1.B8 ; port DP.DP8_M2C_P
DP9_C2M_N: P1.B25 ; port DP.DP9_C2M_N
DP9_C2M_P: P1.B24 ; port DP.DP9_C2M_P
DP9_M2C_N: P1.B5 ; port DP.DP9_M2C_N
DP9_M2C_P: P1.B4 ; port DP.DP9_M2C_P
GA0: P1.C34
GA1: P1.D35
GBTCLK0_M2C_N: P1.D5 ; port CLOCK.GBTCLK0_M2C_N
GBTCLK0_M2C_P: P1.D4 ; port CLOCK.GBTCLK0_M2C_P
GBTCLK1_M2C_N: port CLOCK.GBTCLK1_M2C_N
GBTCLK1_M2C_P: port CLOCK.GBTCLK1_M2C_P
HA00_CC_N: P1.F5 ; port HA.HA00_CC_N
HA00_CC_P: P1.F4 ; port HA.HA00_CC_P
HA01_CC_N: P1.E3 ; port HA.HA01_CC_N
HA01_CC_P: P1.E2 ; port HA.HA01_CC_P
HA02_N: P1.K8 ; port HA.HA02_N
HA02_P: P1.K7 ; port HA.HA02_P
HA03_N: P1.J7 ; port HA.HA03_N
HA03_P: P1.J6 ; port HA.HA03_P
HA04_N: P1.F8 ; port HA.HA04_N
HA04_P: P1.F7 ; port HA.HA04_P
HA05_N: P1.E7 ; port HA.HA05_N
HA05_P: P1.E6 ; port HA.HA05_P
HA06_N: P1.K11 ; port HA.HA06_N
HA06_P: P1.K10 ; port HA.HA06_P
HA07_N: P1.J10 ; port HA.HA07_N
HA07_P: P1.J9 ; port HA.HA07_P
HA08_N: P1.F11 ; port HA.HA08_N
HA08_P: P1.F10 ; port HA.HA08_P
HA09_N: P1.E10 ; port HA.HA09_N
HA09_P: P1.E9 ; port HA.HA09_P
HA10_N: P1.K14 ; port HA.HA10_N
HA10_P: P1.K13 ; port HA.HA10_P
HA11_N: P1.J13 ; port HA.HA11_N
HA11_P: P1.J12 ; port HA.HA11_P
HA12_N: P1.F14 ; port HA.HA12_N
HA12_P: P1.F13 ; port HA.HA12_P
HA13_N: P1.E13 ; port HA.HA13_N
HA13_P: P1.E12 ; port HA.HA13_P
HA14_N: P1.J16 ; port HA.HA14_N
HA14_P: P1.J15 ; port HA.HA14_P
HA15_N: P1.F17 ; port HA.HA15_N
HA15_P: P1.F16 ; port HA.HA15_P
HA16_N: P1.E16 ; port HA.HA16_N
HA16_P: P1.E15 ; port HA.HA16_P
HA17_CC_N: P1.K17 ; port HA.HA17_CC_N
HA17_CC_P: P1.K16 ; port HA.HA17_CC_P
HA18_N: P1.J19 ; port HA.HA18_N
HA18_P: P1.J18 ; port HA.HA18_P
HA19_N: P1.F20 ; port HA.HA19_N
HA19_P: P1.F19 ; port HA.HA19_P
HA20_N: P1.E19 ; port HA.HA20_N
HA20_P: P1.E18 ; port HA.HA20_P
HA21_N: P1.K20 ; port HA.HA21_N
HA21_P: P1.K19 ; port HA.HA21_P
HA22_N: P1.J22 ; port HA.HA22_N
HA22_P: P1.J21 ; port HA.HA22_P
HA23_N: P1.K23 ; port HA.HA23_N
HA23_P: P1.K22 ; port HA.HA23_P
HB00_CC_N: P1.K26 ; port HB.HB00_CC_N
HB00_CC_P: P1.K25 ; port HB.HB00_CC_P
HB01_N: P1.J25 ; port HB.HB01_N
HB01_P: P1.J24 ; port HB.HB01_P
HB02_N: P1.F23 ; port HB.HB02_N
HB02_P: P1.F22 ; port HB.HB02_P
HB03_N: P1.E22 ; port HB.HB03_N
HB03_P: P1.E21 ; port HB.HB03_P
HB04_N: P1.F26 ; port HB.HB04_N
HB04_P: P1.F25 ; port HB.HB04_P
HB05_N: P1.E25 ; port HB.HB05_N
HB05_P: P1.E24 ; port HB.HB05_P
HB06_CC_N: P1.K29 ; port HB.HB06_CC_N
HB06_CC_P: P1.K28 ; port HB.HB06_CC_P
HB07_N: P1.J28 ; port HB.HB07_N
HB07_P: P1.J27 ; port HB.HB07_P
HB08_N: P1.F29 ; port HB.HB08_N
HB08_P: P1.F28 ; port HB.HB08_P
HB09_N: P1.E28 ; port HB.HB09_N
HB09_P: P1.E27 ; port HB.HB09_P
HB10_N: P1.K32 ; port HB.HB10_N
HB10_P: P1.K31 ; port HB.HB10_P
HB11_N: P1.J31 ; port HB.HB11_N
HB11_P: P1.J30 ; port HB.HB11_P
HB12_N: P1.F32 ; port HB.HB12_N
HB12_P: P1.F31 ; port HB.HB12_P
HB13_N: P1.E31 ; port HB.HB13_N
HB13_P: P1.E30 ; port HB.HB13_P
HB14_N: P1.K35 ; port HB.HB14_N
HB14_P: P1.K34 ; port HB.HB14_P
HB15_N: P1.J34 ; port HB.HB15_N
HB15_P: P1.J33 ; port HB.HB15_P
HB16_N: P1.F35 ; port HB.HB16_N
HB16_P: P1.F34 ; port HB.HB16_P
HB17_CC_N: P1.K38 ; port HB.HB17_CC_N
HB17_CC_P: P1.K37 ; port HB.HB17_CC_P
HB18_N: P1.J37 ; port HB.HB18_N
HB18_P: P1.J36 ; port HB.HB18_P
HB19_N: P1.E34 ; port HB.HB19_N
HB19_P: P1.E33 ; port HB.HB19_P
HB20_N: P1.F38 ; port HB.HB20_N
HB20_P: P1.F37 ; port HB.HB20_P
HB21_N: P1.E37 ; port HB.HB21_N
HB21_P: P1.E36 ; port HB.HB21_P
LA00_CC_N: P1.G7 ; port LA.LA00_CC_N
LA00_CC_P: P1.G6 ; port LA.LA00_CC_P
LA01_CC_N: P1.D9 ; port LA.LA01_CC_N
LA01_CC_P: P1.D8 ; port LA.LA01_CC_P
LA02_N: P1.H8 ; port LA.LA02_N
LA02_P: P1.H7 ; port LA.LA02_P
LA03_N: P1.G10 ; port LA.LA03_N
LA03_P: P1.G9 ; port LA.LA03_P
LA04_N: P1.H11 ; port LA.LA04_N
LA04_P: P1.H10 ; port LA.LA04_P
LA05_N: P1.D12 ; port LA.LA05_N
LA05_P: P1.D11 ; port LA.LA05_P
LA06_N: P1.C11 ; port LA.LA06_N
LA06_P: P1.C10 ; port LA.LA06_P
LA07_N: P1.H14 ; port LA.LA07_N
LA07_P: P1.H13 ; port LA.LA07_P
LA08_N: P1.G13 ; port LA.LA08_N
LA08_P: P1.G12 ; port LA.LA08_P
LA09_N: P1.D15 ; port LA.LA09_N
LA09_P: P1.D14 ; port LA.LA09_P
LA10_N: P1.C15 ; port LA.LA10_N
LA10_P: P1.C14 ; port LA.LA10_P
LA11_N: P1.H17 ; port LA.LA11_N
LA11_P: P1.H16 ; port LA.LA11_P
LA12_N: P1.G16 ; port LA.LA12_N
LA12_P: P1.G15 ; port LA.LA12_P
LA13_N: P1.D18 ; port LA.LA13_N
LA13_P: P1.D17 ; port LA.LA13_P  [project net FPGA_TX_CLK]
LA14_N: P1.C19 ; port LA.LA14_N
LA14_P: P1.C18 ; port LA.LA14_P
LA15_N: P1.H20 ; port LA.LA15_N
LA15_P: P1.H19 ; port LA.LA15_P
LA16_N: P1.G19 ; port LA.LA16_N
LA16_P: P1.G18 ; port LA.LA16_P
LA17_CC_N: P1.D21 ; port LA.LA17_CC_N
LA17_CC_P: P1.D20 ; port LA.LA17_CC_P
LA18_CC_N: P1.C23 ; port LA.LA18_CC_N
LA18_CC_P: P1.C22 ; port LA.LA18_CC_P
LA19_N: P1.H23 ; port LA.LA19_N
LA19_P: P1.H22 ; port LA.LA19_P
LA20_N: P1.G22 ; port LA.LA20_N
LA20_P: P1.G21 ; port LA.LA20_P
LA21_N: P1.H26 ; port LA.LA21_N
LA21_P: P1.H25 ; port LA.LA21_P
LA22_N: P1.G25 ; port LA.LA22_N
LA22_P: P1.G24 ; port LA.LA22_P
LA23_N: P1.D24 ; port LA.LA23_N
LA23_P: P1.D23 ; port LA.LA23_P
LA24_N: P1.H29 ; port LA.LA24_N
LA24_P: P1.H28 ; port LA.LA24_P
LA25_N: P1.G28 ; port LA.LA25_N
LA25_P: P1.G27 ; port LA.LA25_P
LA26_N: P1.D27 ; port LA.LA26_N
LA26_P: P1.D26 ; port LA.LA26_P
LA27_N: P1.C27 ; port LA.LA27_N
LA27_P: P1.C26 ; port LA.LA27_P
LA28_N: P1.H32 ; port LA.LA28_N
LA28_P: P1.H31 ; port LA.LA28_P
LA29_N: P1.G31 ; port LA.LA29_N
LA29_P: P1.G30 ; port LA.LA29_P
LA30_N: P1.H35 ; port LA.LA30_N
LA30_P: P1.H34 ; port LA.LA30_P
LA31_N: P1.G34 ; port LA.LA31_N
LA31_P: P1.G33 ; port LA.LA31_P
LA32_N: P1.H38 ; port LA.LA32_N
LA32_P: P1.H37 ; port LA.LA32_P
LA33_N: P1.G37 ; port LA.LA33_N
LA33_P: P1.G36 ; port LA.LA33_P
PG_C2M: P1.D1 ; port MISC.PG_C2M
PG_M2C: P1.F1 ; port MISC.PG_M2C
PRSNT_M2C_L: P1.H2 ; port MISC.PRSNT_M2C_L
SCL: P1.C30 ; port I2C.SCL
SDA: P1.C31 ; port I2C.SDA
TCK: P1.D29 ; port JTAG.TCK  [project net JTAG_TCK]
TDI: P1.D30 ; port JTAG.TDI  [project net JTAG_TDI]
TDO: P1.D31 ; port JTAG.TDO  [project net JTAG_TDO]
TMS: P1.D33 ; port JTAG.TMS  [project net JTAG_TMS]
TRST_L: P1.D34 ; port JTAG.TRST_L  [project net ~{uC_RESET}]
VIO_B_M2C: P1.J39 P1.K40 ; port POWER.VIO_B_M2C
VREF_A_M2C: P1.H1 ; port VREF.VREF_A_M2C
VREF_B_M2C: P1.K1 ; port VREF.VREF_B_M2C

Not connected (* = marked no-connect by the designer): P1 B20 B21 B40*

### Buses and harness runs
bus GA[0..1]

### Layout directives
differential pair: CLK0_M2C_N, CLK0_M2C_P, CLK1_M2C_N, CLK1_M2C_P, CLK2_BIDIR_N, CLK2_BIDIR_P, CLK3_BIDIR_N, CLK3_BIDIR_P, DP0_C2M_N, DP0_C2M_P, DP0_M2C_N, DP0_M2C_P, DP1_C2M_N, DP1_C2M_P, DP1_M2C_N, DP1_M2C_P, DP2_C2M_N, DP2_C2M_P, DP2_M2C_N, DP2_M2C_P, DP3_C2M_N, DP3_C2M_P, DP3_M2C_N, DP3_M2C_P, DP4_C2M_N, DP4_C2M_P, DP4_M2C_N, DP4_M2C_P, DP5_C2M_N, DP5_C2M_P, DP5_M2C_N, DP5_M2C_P, DP6_C2M_N, DP6_C2M_P, DP6_M2C_N, DP6_M2C_P, DP7_C2M_N, DP7_C2M_P, DP7_M2C_N, DP7_M2C_P, DP8_C2M_N, DP8_C2M_P, DP8_M2C_N, DP8_M2C_P, DP9_C2M_N, DP9_C2M_P, DP9_M2C_N, DP9_M2C_P, GBTCLK0_M2C_N, GBTCLK0_M2C_P, GBTCLK1_M2C_N, GBTCLK1_M2C_P, HA00_CC_N, HA00_CC_P, HA01_CC_N, HA01_CC_P, HA02_N, HA02_P, HA03_N, HA03_P, HA04_N, HA04_P, HA05_N, HA05_P, HA06_N, HA06_P, HA07_N, HA07_P, HA08_N, HA08_P, HA09_N, HA09_P, HA10_N, HA10_P, HA11_N, HA11_P, HA12_N, HA12_P, HA13_N, HA13_P, HA14_N, HA14_P, HA15_N, HA15_P, HA16_N, HA16_P, HA17_CC_N, HA17_CC_P, HA18_N, HA18_P, HA19_N, HA19_P, HA20_N, HA20_P, HA21_N, HA21_P, HA22_N, HA22_P, HA23_N, HA23_P, HB00_CC_N, HB00_CC_P, HB01_N, HB01_P, HB02_N, HB02_P, HB03_N, HB03_P, HB04_N, HB04_P, HB05_N, HB05_P, HB06_CC_N, HB06_CC_P, HB07_N, HB07_P, HB08_N, HB08_P, HB09_N, HB09_P, HB10_N, HB10_P, HB11_N, HB11_P, HB12_N, HB12_P, HB13_N, HB13_P, HB14_N, HB14_P, HB15_N, HB15_P, HB16_N, HB16_P, HB17_CC_N, HB17_CC_P, HB18_N, HB18_P, HB19_N, HB19_P, HB20_N, HB20_P, HB21_N, HB21_P

### Notes on the sheet
- RES0
- Sheet Title
- Project Title
- Size:
- Date:
- A3
- Item:
- Time:
- Revision:
- Sheet
- of
- File:

### Library data of the parts
P1 = CN-2P-2M-R400: Board-to-Board Connector, Vertical, 10-Row, Pitch 1.27mm, 400-Position; Manufacturer: Molex; Manufacturer Part Number: 45970-4115; Current Rating: 2.7 A; Voltage Rating: 240 V; Number of Positions / Contacts: 400; Supplier 1: Mouser; RoHS: RoHS Compliant; Category: Board to Board & Mezzanine Connectors; Stock 1: 161; Pricing 1: 1=36.56, 10=32.14, 100=28.08, 300=26.87 (USD); Contact Plating: Gold; Housing Material: Thermoplastic; Mounting Angle: Vertical; Number of Rows: 10; Packaging: Reel; Series: 45970; Termination Style: SMD; Brand: Molex; Contact Material: Copper Alloy; Pitch: 1.27 mm; Product Category: Mezzanine Connectors; Product Type: Plugs; Standard Pack Qty: 300; Tradename: SEARAY; RoHS - Mouser: Y; Minimum Order Quantity: 1; Reeling: True; ComponentLink1URL: http://www.mouser.com/ds/2/276/0459704115_PCB_HEADERS-169229.pdf; ComponentLink1Description: http://www.mouser.com/ds/2/276/0459704115_PCB_HEADERS-169229.pdf

## Nets that join several sheets
3P3V: WAB_1_1_top_level (49 pins), FMC_HPC_400 (P1.C39 P1.D36 P1.D38 P1.D40)
12P0V: WAB_1_1_top_level (19 pins), FMC_HPC_400 (P1.C35 P1.C37)
GND: WAB_1_1_top_level (68 pins), FMC_HPC_400 (159 pins)
VADJ: WAB_1_1_top_level (18 pins), FMC_HPC_400 (P1.E39 P1.F40 P1.G39 P1.H40)
~{uC_RESET}: WAB_1_1_top_level (J1.122), FMC_HPC_400 (P1.D34)
CLK0_M2C_N: WAB_1_1_top_level (R6.1), FMC_HPC_400 (P1.H5)
CLK0_M2C_P: WAB_1_1_top_level (R5.1 R8.1), FMC_HPC_400 (P1.H4)
CLK2_BIDIR_N: WAB_1_1_top_level (R16.1 U5.20), FMC_HPC_400 (P1.K5)
CLK2_BIDIR_P: WAB_1_1_top_level (R16.2 U5.21), FMC_HPC_400 (P1.K4)
CLK3_BIDIR_N: WAB_1_1_top_level (R11.1 U4.20), FMC_HPC_400 (P1.J3)
CLK3_BIDIR_P: WAB_1_1_top_level (R11.2 U4.21), FMC_HPC_400 (P1.J2)
DP0_C2M_N: WAB_1_1_top_level (J3.2), FMC_HPC_400 (P1.C3)
DP0_C2M_P: WAB_1_1_top_level (J3.1), FMC_HPC_400 (P1.C2)
FPGA_TX_CLK: WAB_1_1_top_level (R4.1), FMC_HPC_400 (P1.D17)
HA00_CC_N: WAB_1_1_top_level (J3.4), FMC_HPC_400 (P1.F5)
HA00_CC_P: WAB_1_1_top_level (J3.3), FMC_HPC_400 (P1.F4)
HA01_CC_N: WAB_1_1_top_level (J3.6), FMC_HPC_400 (P1.E3)
HA01_CC_P: WAB_1_1_top_level (J3.5), FMC_HPC_400 (P1.E2)
HA02_N: WAB_1_1_top_level (J2.4), FMC_HPC_400 (P1.K8)
HA02_P: WAB_1_1_top_level (J2.3), FMC_HPC_400 (P1.K7)
HA03_N: WAB_1_1_top_level (J3.7), FMC_HPC_400 (P1.J7)
HA03_P: WAB_1_1_top_level (J3.8), FMC_HPC_400 (P1.J6)
HA04_N: WAB_1_1_top_level (J2.6), FMC_HPC_400 (P1.F8)
HA04_P: WAB_1_1_top_level (J2.5), FMC_HPC_400 (P1.F7)
HA05_N: WAB_1_1_top_level (J2.2), FMC_HPC_400 (P1.E7)
HA05_P: WAB_1_1_top_level (J2.1), FMC_HPC_400 (P1.E6)
HA09_N: WAB_1_1_top_level (J2.8), FMC_HPC_400 (P1.E10)
HA09_P: WAB_1_1_top_level (J2.7), FMC_HPC_400 (P1.E9)
LA00_CC_N: WAB_1_1_top_level (J1.42), FMC_HPC_400 (P1.G7)
LA00_CC_P: WAB_1_1_top_level (J1.44), FMC_HPC_400 (P1.G6)
LA02_N: WAB_1_1_top_level (J1.43), FMC_HPC_400 (P1.H8)
LA02_P: WAB_1_1_top_level (J1.41), FMC_HPC_400 (P1.H7)
LA03_N: WAB_1_1_top_level (J1.56), FMC_HPC_400 (P1.G10)
LA03_P: WAB_1_1_top_level (J1.54), FMC_HPC_400 (P1.G9)
LA04_N: WAB_1_1_top_level (J1.55), FMC_HPC_400 (P1.H11)
LA04_P: WAB_1_1_top_level (J1.53), FMC_HPC_400 (P1.H10)
LA05_N: WAB_1_1_top_level (J1.61), FMC_HPC_400 (P1.D12)
LA05_P: WAB_1_1_top_level (J1.59), FMC_HPC_400 (P1.D11)
LA06_N: WAB_1_1_top_level (J1.50), FMC_HPC_400 (P1.C11)
LA06_P: WAB_1_1_top_level (J1.48), FMC_HPC_400 (P1.C10)
LA07_N: WAB_1_1_top_level (J1.73), FMC_HPC_400 (P1.H14)
LA07_P: WAB_1_1_top_level (J1.71), FMC_HPC_400 (P1.H13)
LA08_N: WAB_1_1_top_level (J1.67), FMC_HPC_400 (P1.G13)
LA08_P: WAB_1_1_top_level (J1.65), FMC_HPC_400 (P1.G12)
LA09_N: WAB_1_1_top_level (J1.49), FMC_HPC_400 (P1.D15)
LA09_P: WAB_1_1_top_level (J1.47), FMC_HPC_400 (P1.D14)
LA10_N: WAB_1_1_top_level (J1.62), FMC_HPC_400 (P1.C15)
LA10_P: WAB_1_1_top_level (J1.60), FMC_HPC_400 (P1.C14)
LA11_N: WAB_1_1_top_level (U1.4), FMC_HPC_400 (P1.H17)
LA12_N: WAB_1_1_top_level (U1.3), FMC_HPC_400 (P1.G16)
LA12_P: WAB_1_1_top_level (R9.2), FMC_HPC_400 (P1.G15)
LA13_N: WAB_1_1_top_level (U2.10), FMC_HPC_400 (P1.D18)
LA15_N: WAB_1_1_top_level (J1.74), FMC_HPC_400 (P1.H20)
LA15_P: WAB_1_1_top_level (J1.72), FMC_HPC_400 (P1.H19)
LA16_N: WAB_1_1_top_level (J1.68), FMC_HPC_400 (P1.G19)
LA16_P: WAB_1_1_top_level (J1.66), FMC_HPC_400 (P1.G18)
LA18_CC_P: WAB_1_1_top_level (U2.6), FMC_HPC_400 (P1.C22)
LA19_N: WAB_1_1_top_level (J1.80), FMC_HPC_400 (P1.H23)
LA19_P: WAB_1_1_top_level (U3.6), FMC_HPC_400 (P1.H22)
LA20_N: WAB_1_1_top_level (U3.8), FMC_HPC_400 (P1.G22)
LA20_P: WAB_1_1_top_level (U3.7), FMC_HPC_400 (P1.G21)
LA22_N: WAB_1_1_top_level (U2.9), FMC_HPC_400 (P1.G25)
LA23_N: WAB_1_1_top_level (U3.3), FMC_HPC_400 (P1.D24)
LA23_P: WAB_1_1_top_level (U2.7), FMC_HPC_400 (P1.D23)
LA24_P: WAB_1_1_top_level (U2.8), FMC_HPC_400 (P1.H28)
LA25_N: WAB_1_1_top_level (U3.5), FMC_HPC_400 (P1.G28)
LA25_P: WAB_1_1_top_level (U3.4), FMC_HPC_400 (P1.G27)
LA27_N: WAB_1_1_top_level (U2.3), FMC_HPC_400 (P1.C27)
LA27_P: WAB_1_1_top_level (U2.4), FMC_HPC_400 (P1.C26)
LA30_P: WAB_1_1_top_level (U2.5), FMC_HPC_400 (P1.H34)
PRSNT_M2C_L: WAB_1_1_top_level (J1.160), FMC_HPC_400 (P1.H2)

## Assembly variants
Normal Production: not fitted J2 J3 R2 R3 R6 R8 R10